# EAGLE design Aux_pcb (EAGLE 9.2.0)
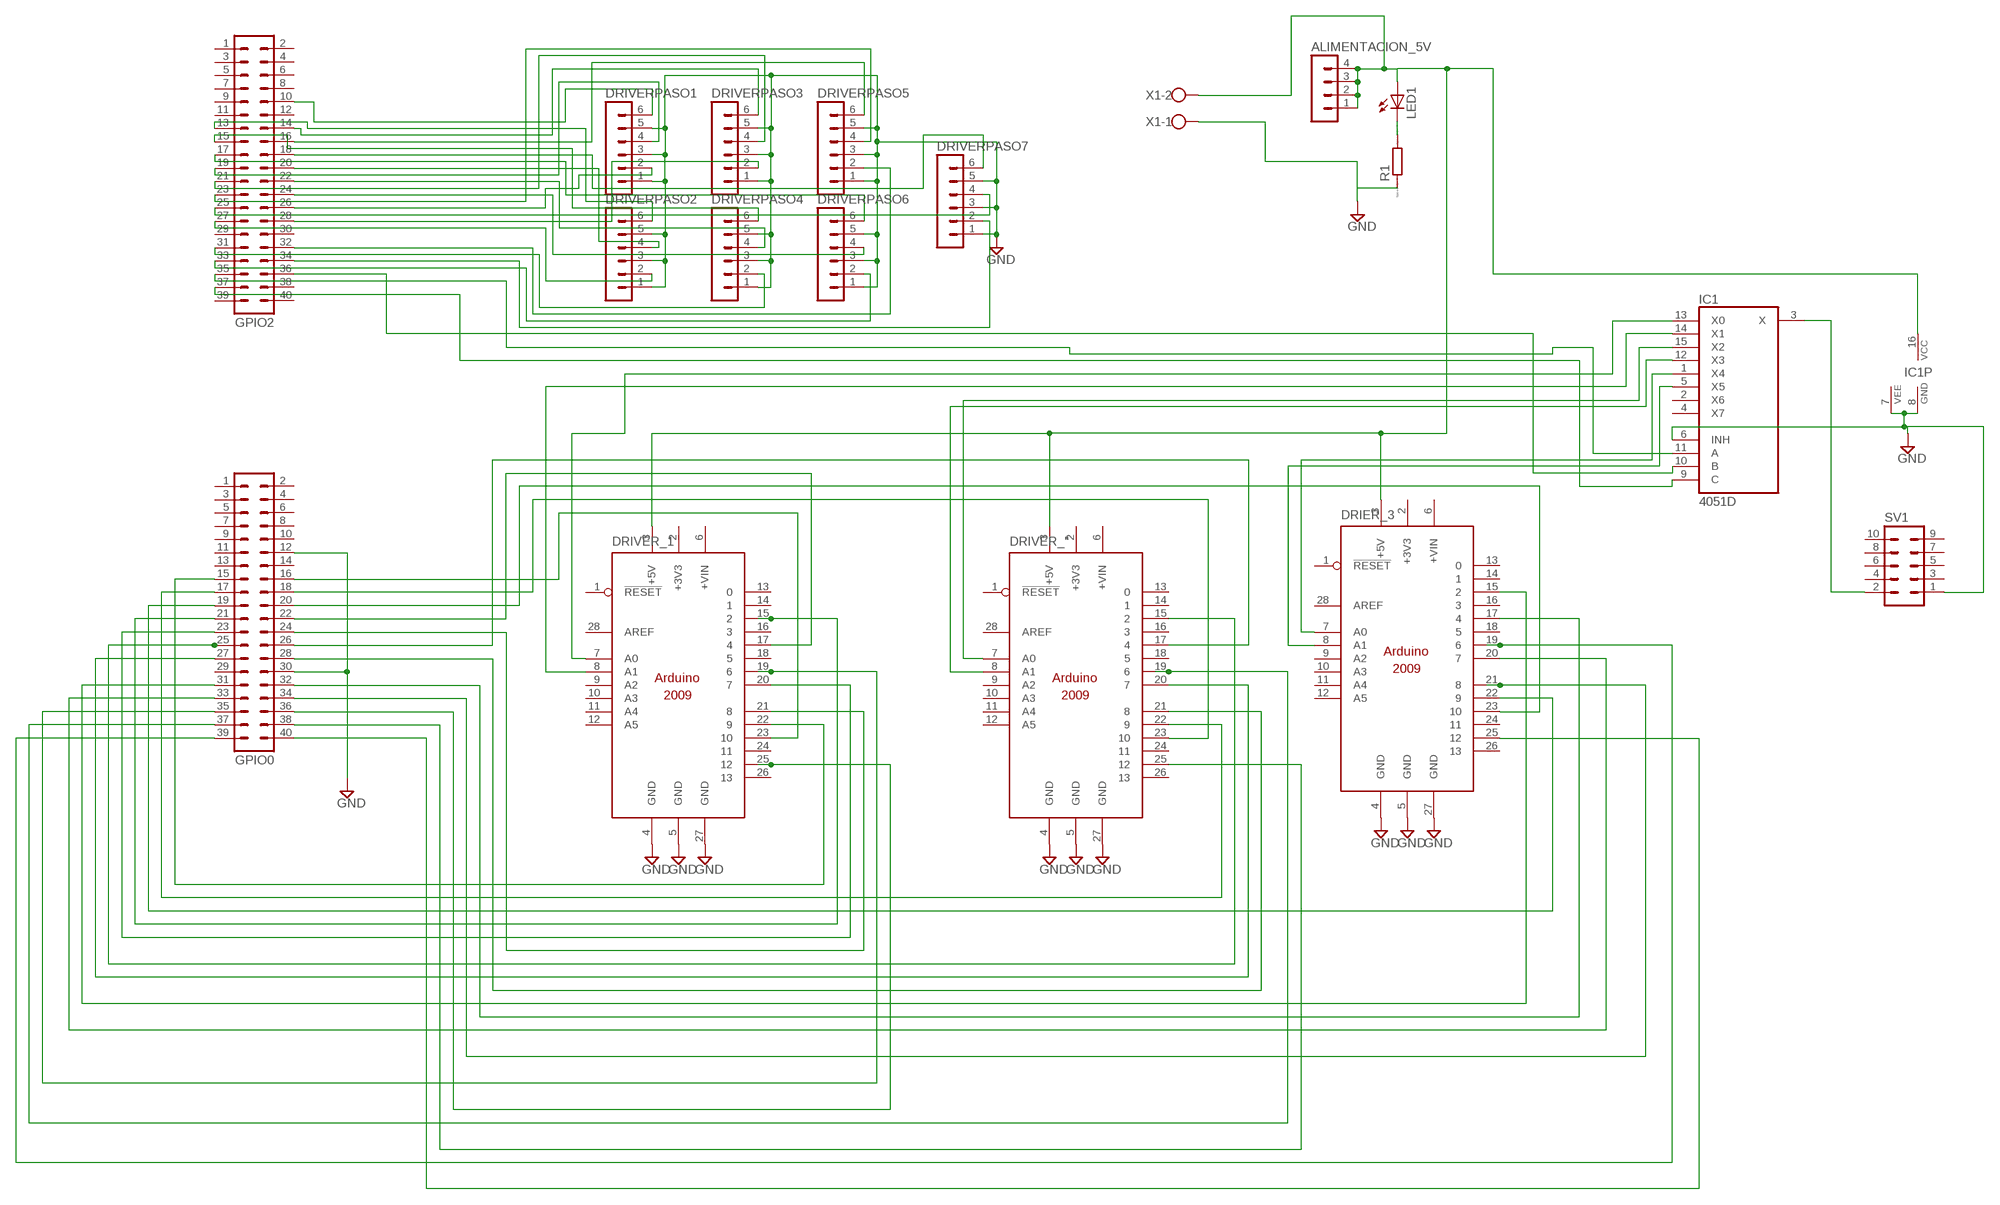
[diagram p0: schematic, sheet 1]

## Parts
ALIMENTACION_5V  MA04-1  [MA04-1]
DRIER_3  ARDUINO2009_10  [ARDUINO2009]
DRIVER_1  ARDUINO2009_10  [ARDUINO2009]
DRIVER_"  ARDUINO2009_10  [ARDUINO2009]
DRIVERPASO1  MA06-1  [MA06-1]
DRIVERPASO2  MA06-1  [MA06-1]
DRIVERPASO3  MA06-1  [MA06-1]
DRIVERPASO4  MA06-1  [MA06-1]
DRIVERPASO5  MA06-1  [MA06-1]
DRIVERPASO6  MA06-1  [MA06-1]
DRIVERPASO7  MA06-1  [MA06-1]
GPIO0  MA20-2  [MA20-2]
GPIO2  MA20-2  [MA20-2]
IC1  4051D  [SO16]
LED1  LEDSML0805  [SML0805]
R1  RR1206  [R1206]
SV1  MA05-2  [MA05-2]
X1  W237-102  [W237-102]

## Nets
+5V: ALIMENTACION_5V.1 ALIMENTACION_5V.2 ALIMENTACION_5V.3 ALIMENTACION_5V.4 DRIER_3.3(+5V) DRIVER_1.3(+5V) DRIVER_".3(+5V) IC1.16(VCC) LED1.A X1.2
GND: DRIER_3.4(GND) DRIER_3.5(GND) DRIER_3.27(GND) DRIVER_1.4(GND) DRIVER_1.5(GND) DRIVER_1.27(GND) DRIVER_".4(GND) DRIVER_".5(GND) DRIVER_".27(GND) DRIVERPASO1.1 DRIVERPASO1.3 DRIVERPASO1.5 DRIVERPASO2.1 DRIVERPASO2.3 DRIVERPASO2.5 DRIVERPASO3.1 DRIVERPASO3.3 DRIVERPASO3.5 DRIVERPASO4.1 DRIVERPASO4.3 DRIVERPASO4.5 DRIVERPASO5.1 DRIVERPASO5.3 DRIVERPASO5.5 DRIVERPASO6.1 DRIVERPASO6.3 DRIVERPASO6.5 DRIVERPASO7.1 DRIVERPASO7.3 DRIVERPASO7.5 GPIO0.12 GPIO0.30 IC1.6(INH) IC1.7(VEE) IC1.8(GND) R1.1 SV1.1 X1.1
N$2: DRIVER_1.7(A0) IC1.13(X0)
N$6: DRIVERPASO1.6 GPIO2.10
N$7: DRIVERPASO2.6 GPIO2.13
N$8: DRIVERPASO3.6 GPIO2.14
N$9: DRIVERPASO4.6 GPIO2.15
N$10: DRIVERPASO5.6 GPIO2.16
N$11: DRIVERPASO6.6 GPIO2.17
N$12: DRIVERPASO7.6 GPIO2.18
N$13: DRIVER_1.22 GPIO0.15
N$14: DRIVER_1.23 GPIO0.16
N$15: DRIVER_".22 GPIO0.17
N$16: DRIVER_".23 GPIO0.18
N$17: DRIER_3.22 GPIO0.19
N$18: DRIER_3.23 GPIO0.20
N$19: DRIVER_1.15 GPIO0.21
N$20: DRIVER_1.17 GPIO0.22
N$21: DRIVER_1.20 GPIO0.23
N$22: DRIVER_1.21 GPIO0.24
N$23: DRIVER_".15 GPIO0.25
N$24: DRIVER_".17 GPIO0.26
N$25: DRIVER_".20 GPIO0.27
N$26: DRIVER_".21 GPIO0.28
N$27: DRIER_3.15 GPIO0.31
N$28: DRIER_3.17 GPIO0.32
N$29: DRIER_3.20 GPIO0.33
N$30: DRIER_3.21 GPIO0.34
N$31: DRIVER_1.19 GPIO0.35
N$32: DRIVER_1.25 GPIO0.36
N$33: DRIVER_".19 GPIO0.37
N$34: DRIVER_".25 GPIO0.38
N$35: DRIER_3.19 GPIO0.39
N$36: DRIER_3.25 GPIO0.40
N$37: DRIVERPASO1.4 GPIO2.19
N$38: DRIVERPASO2.4 GPIO2.20
N$39: DRIVERPASO3.4 GPIO2.21
N$40: DRIVERPASO4.4 GPIO2.22
N$41: DRIVERPASO5.4 GPIO2.23
N$42: DRIVERPASO6.4 GPIO2.24
N$43: DRIVERPASO7.4 GPIO2.25
N$44: DRIVERPASO1.2 GPIO2.26
N$45: DRIVERPASO2.2 GPIO2.27
N$46: DRIVERPASO3.2 GPIO2.28
N$47: DRIVERPASO4.2 GPIO2.31
N$48: DRIVERPASO5.2 GPIO2.32
N$49: DRIVERPASO6.2 GPIO2.33
N$50: DRIVERPASO7.2 GPIO2.34
N$51: DRIVER_1.8(A1) IC1.14(X1)
N$52: DRIVER_".7(A0) IC1.15(X2)
N$53: DRIVER_".8(A1) IC1.12(X3)
N$54: DRIER_3.7(A0) IC1.1(X4)
N$55: DRIER_3.8(A1) IC1.5(X5)
N$56: IC1.3(X) SV1.2
N$58: GPIO2.35 IC1.11(A)
N$59: GPIO2.36 IC1.10(B)
N$60: GPIO2.37 IC1.9(C)
N$167: LED1.C R1.2
Unconnected: DRIER_3.1(!RESET) DRIER_3.6(+VIN) DRIER_3.9(A2) DRIER_3.10(A3) DRIER_3.11(A4) DRIER_3.12(A5) DRIER_3.13 DRIER_3.14 DRIER_3.16 DRIER_3.18 DRIER_3.24 DRIER_3.26 DRIER_3.28(AREF) DRIVER_1.1(!RESET) DRIVER_1.6(+VIN) DRIVER_1.9(A2) DRIVER_1.10(A3) DRIVER_1.11(A4) DRIVER_1.12(A5) DRIVER_1.13 DRIVER_1.14 DRIVER_1.16 DRIVER_1.18 DRIVER_1.24 DRIVER_1.26 DRIVER_1.28(AREF) DRIVER_".1(!RESET) DRIVER_".6(+VIN) DRIVER_".9(A2) DRIVER_".10(A3) DRIVER_".11(A4) DRIVER_".12(A5) DRIVER_".13 DRIVER_".14 DRIVER_".16 DRIVER_".18 DRIVER_".24 DRIVER_".26 DRIVER_".28(AREF) GPIO0.1 GPIO0.2 GPIO0.3 GPIO0.4 GPIO0.5 GPIO0.6 GPIO0.7 GPIO0.8 GPIO0.9 GPIO0.10 GPIO0.11 GPIO0.13 GPIO0.14 GPIO0.29 GPIO2.1 GPIO2.2 GPIO2.3 GPIO2.4 GPIO2.5 GPIO2.6 GPIO2.7 GPIO2.8 GPIO2.9 GPIO2.11 GPIO2.12 GPIO2.29 GPIO2.30 GPIO2.38 GPIO2.39 GPIO2.40 IC1.2(X6) IC1.4(X7) SV1.3 SV1.4 SV1.5 SV1.6 SV1.7 SV1.8 SV1.9 SV1.10

## Power pins joined to a net without a drawn wire
+3V3: DRIER_3.2(+3V3) DRIVER_1.2(+3V3) DRIVER_".2(+3V3)

## Library data of the parts
ALIMENTACION_5V = con-lstb:MA04-1: PIN HEADER; OC_FARNELL: unknown; OC_NEWARK: unknown
DRIER_3 DRIVER_1 DRIVER_" = arduino:ARDUINO2009_1: The Arduino Duemilanove ("2009") is a microcontroller board based on the ATmega168 or ATmega328. - 14 digital input/output pins (of which 6 can be used as PWM outputs) - 6 analog inputs, a 16 MHz crystal oscillator - USB connection - power jack - ISP header - reset button It contains everything needed to support the microcontroller; simply connect it to a computer with a USB cable or power it with a AC-to-DC adapter or battery to get started http://arduino.cc/en/Main/ArduinoBoardDuemilanove
DRIVERPASO1-DRIVERPASO7 = con-lstb:MA06-1: PIN HEADER; OC_FARNELL: unknown; OC_NEWARK: unknown
GPIO0 GPIO2 = con-lstb:MA20-2: PIN HEADER; OC_FARNELL: unknown; OC_NEWARK: unknown
IC1 = 40xx:4051: 8-channel ANALOG MULTIPLEXER
LED1 = led:LED: LED OSRAM: - CHIPLED LG R971, LG N971, LY N971, LG Q971, LY Q971, LO R971, LY R971 LH N974, LH R974 LS Q976, LO Q976, LY Q976 LO Q996 - Hyper CHIPLED LW Q18S LB Q993, LB Q99A, LB R99A - SideLED LS A670, LO A670, LY A670, LG A670, LP A670 LB A673, LV A673, LT A673, LW A673 LH A674 LY A675 LS A676, LA A676, LO A676, LY A676, LW A676 LS A679, LY A679, LG A679 - Hyper Micro SIDELED® LS Y876, LA Y876, LO Y876, LY Y876 LT Y87S - SmartLED LW L88C, LW L88S LB L89C, LB L89S, LG L890 LS L89K, LO L89K, LY L89K LS L896, LA L896, LO L896, LY L896 - TOPLED LS T670, LO T670, LY T670, LG T670, LP T670 LSG T670, LSP T670, LSY T670, LOP T670, LYG T670 LG T671, LOG T671, LSG T671 LB T673, LV T673, LT T673, LW T673 LH T674 LS T676, LA T676, LO T676, LY T676, LB T676, LH T676, LSB T676, LW T676 LB T67C, LV T67C, LT T67C, LS T67K, LO T67K, LY T67K, LW E67C LS E67B, LA E67B, LO E67B, LY E67B, LB E67C, LV E67C, LT E67C LW T67C LS T679, LY T679, LG T679 LS T770, LO T770, LY T770, LG T770, LP T770 LB T773, LV T773, LT T773, LW T773 LH T774 LS E675, LA E675, LY E675, LS T675 LS T776, LA T776, LO T776, LY T776, LB T776 LHGB T686 LT T68C, LB T68C - Hyper Mini TOPLED® LB M676 - Mini TOPLED Santana® LG M470 LS M47K, LO M47K, LY M47K Source: http://www.osram.convergy.de LUXEON: - LUMILED® LXK2-PW12-R00, LXK2-PW12-S00, LXK2-PW14-U00, LXK2-PW14-V00 LXK2-PM12-R00, LXK2-PM12-S00, LXK2-PM14-U00 LXK2-PE12-Q00, LXK2-PE12-R00, LXK2-PE12-S00, LXK2-PE14-T00, LXK2-PE14-U00 LXK2-PB12-K00, LXK2-PB12-L00, LXK2-PB12-M00, LXK2-PB14-N00, LXK2-PB14-P00, LXK2-PB14-Q00 LXK2-PR12-L00, LXK2-PR12-M00, LXK2-PR14-Q00, LXK2-PR14-R00 LXK2-PD12-Q00, LXK2-PD12-R00, LXK2-PD12-S00 LXK2-PH12-R00, LXK2-PH12-S00 LXK2-PL12-P00, LXK2-PL12-Q00, LXK2-PL12-R00 Source: www.luxeon.com KINGBRIGHT: KA-3528ASYC Source: www.kingbright.com
R1 = eagle-ltspice:R: RESISTOR, European symbol; SPICEMODEL: NONE; SPICEPREFIX: R
SV1 = con-lstb:MA05-2: PIN HEADER; OC_FARNELL: unknown; OC_NEWARK: unknown
X1 = con-wago-500:W237-102: WAGO SCREW CLAMP; MPN: 237-102; OC_FARNELL: unknown; OC_NEWARK: 70K9898

## Board
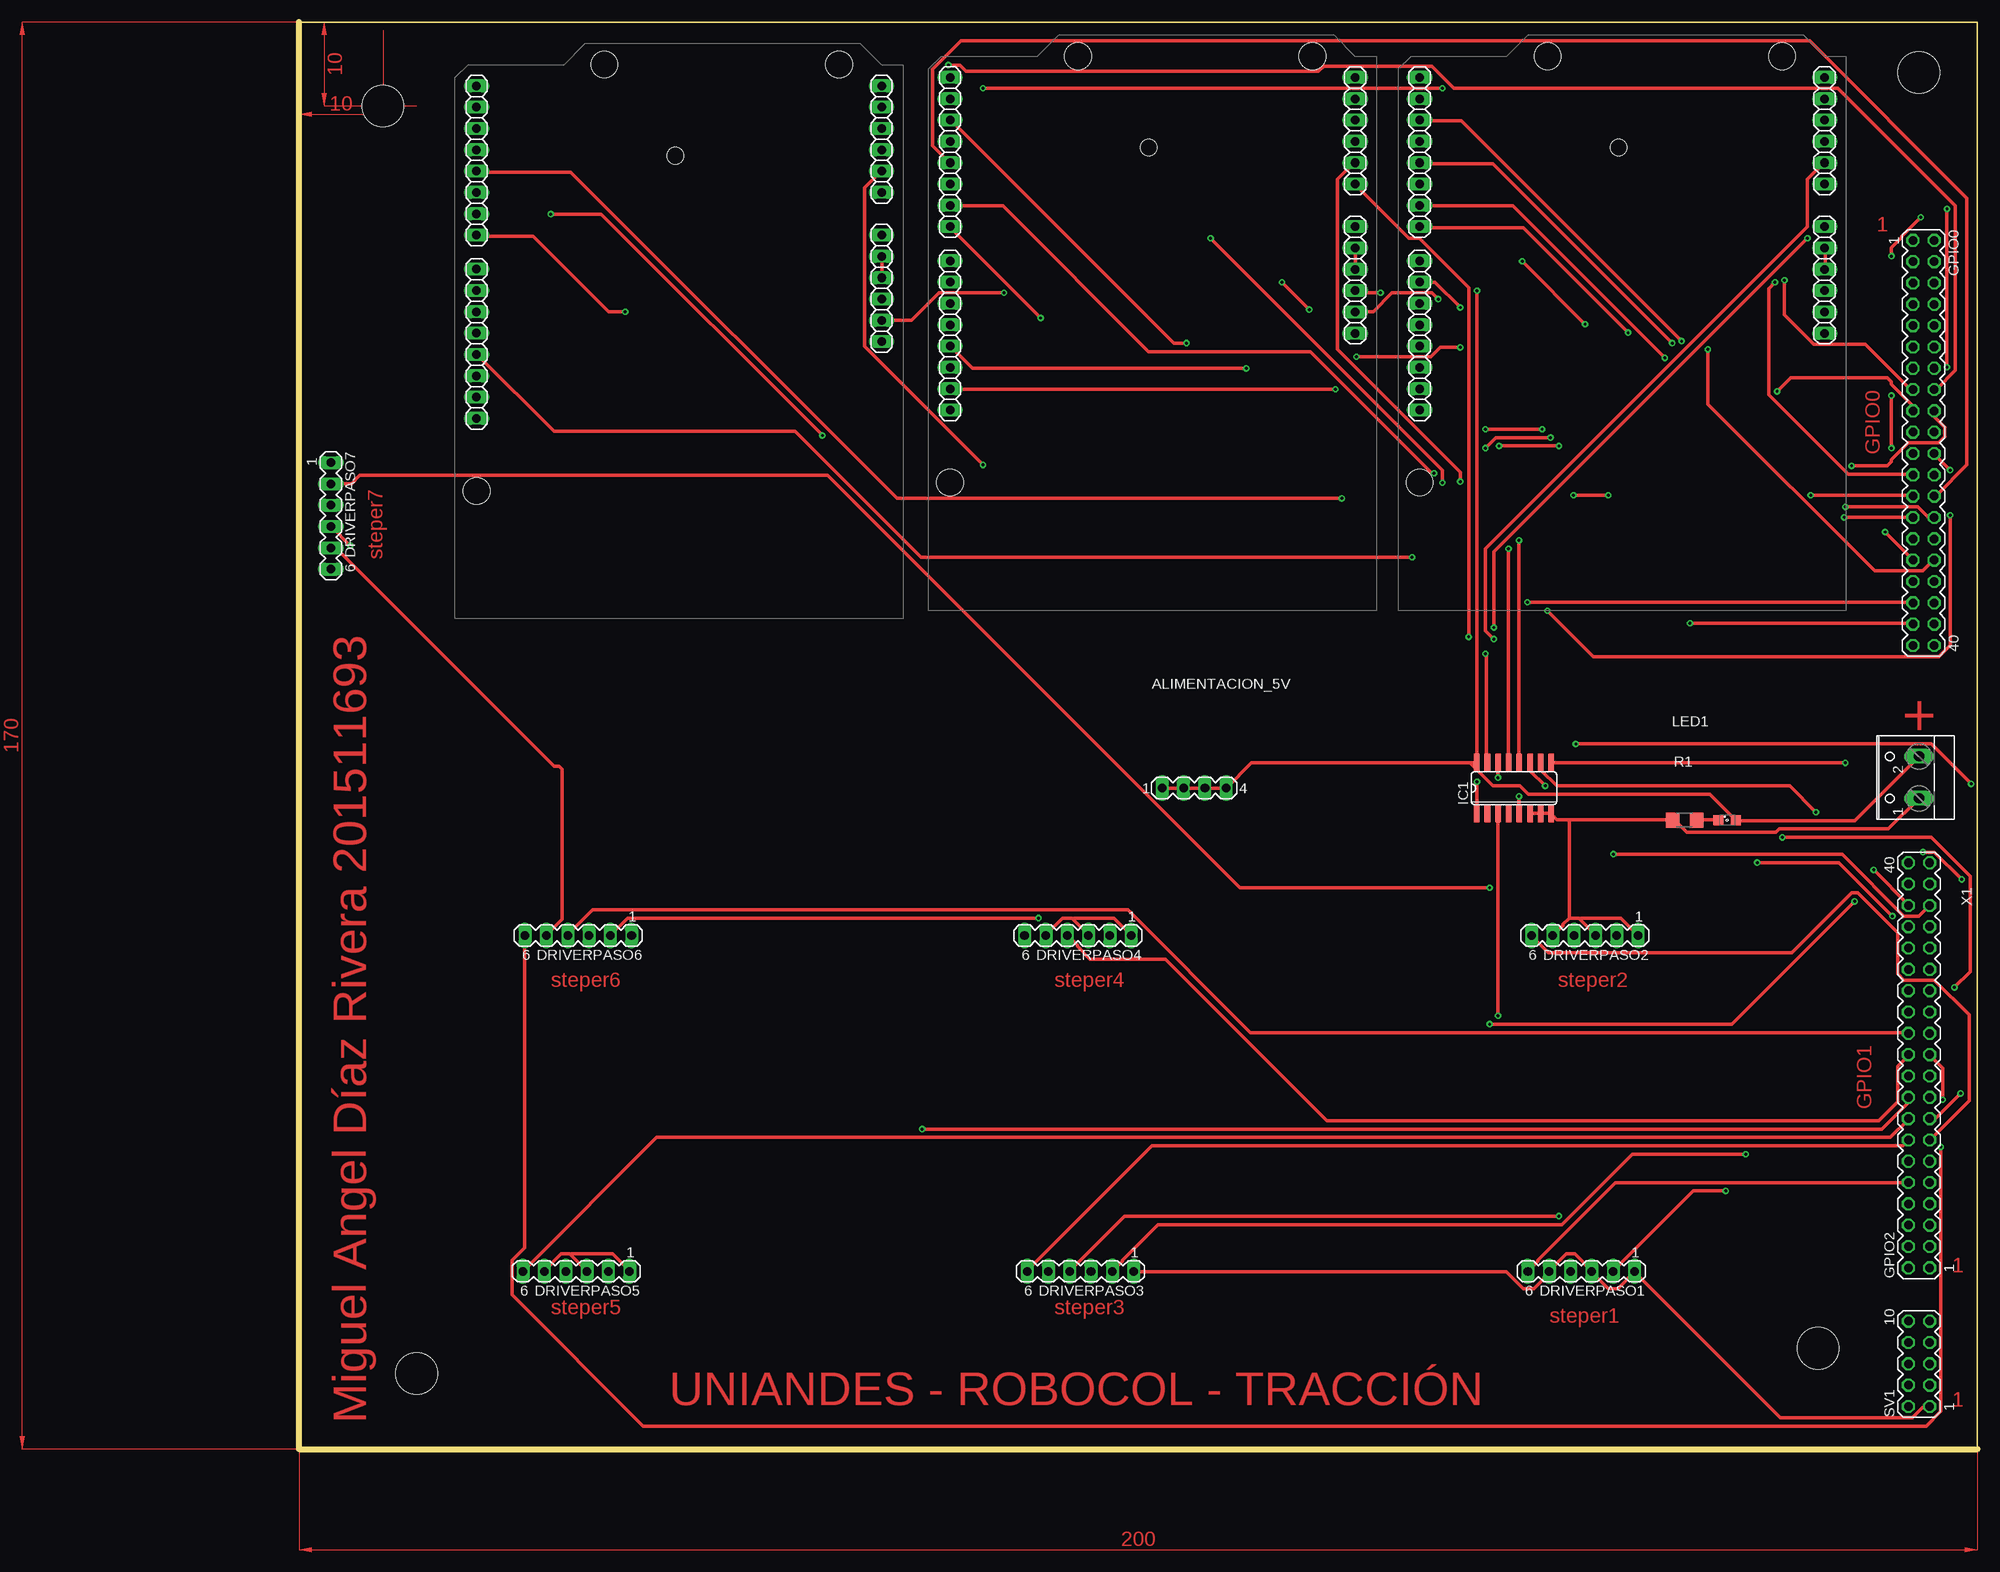
[diagram p1: board, top side]
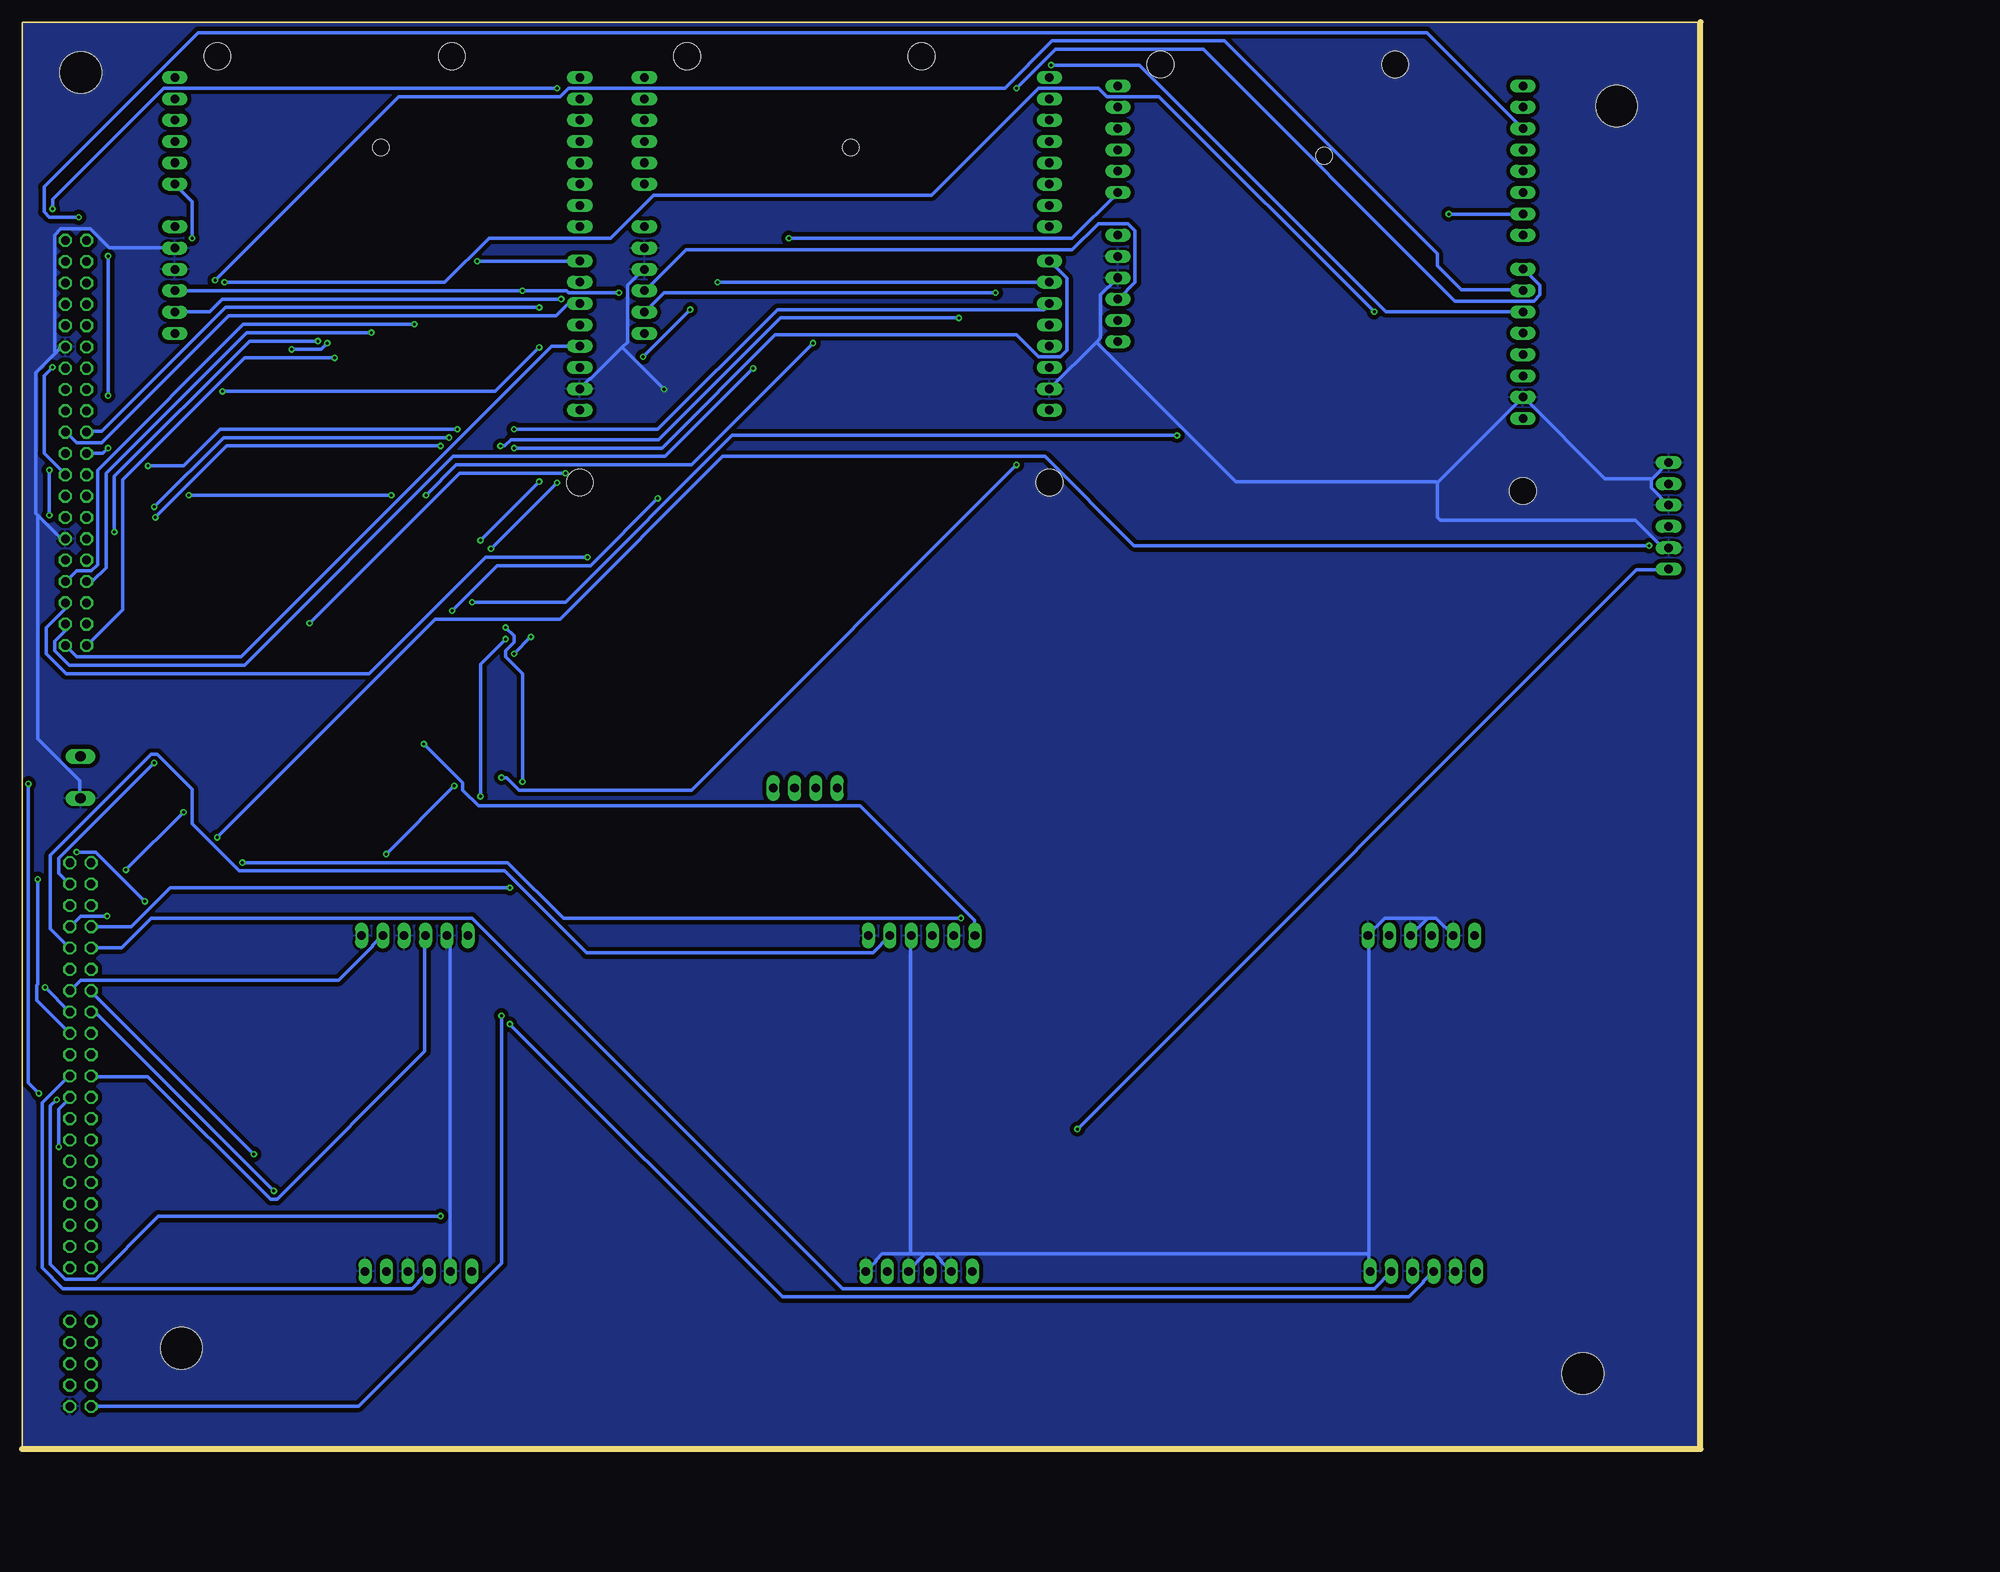
[diagram p2: board, bottom side, seen from below]

Size 200 x 170 mm. Coordinates in mm from the lower left corner, seen from the top.
Outline: 200,0 200,170 0,170 0,0 200,0
Copper layers (1*16): Top 0.035mm / dielectric 1.5mm / Bottom 0.035mm
Design rules "default *": minimum track width 0.4mm, minimum drill 0.35mm, track to track 0.5mm, track to pad 0.3mm, pad to pad 0.3mm, via to via 0.3mm, smd to smd 0.4mm, copper to edge 0mil, drill to drill 8mil, minimum pad ring 10mil, minimum via ring 8mil, stop-mask expansion 4mil, vias tented up to drill 0mil, thermal gap 12mil
Holes 5 mm at 10,160 14,9 181,12 193,164

### Footprints (pad centres in the part's own frame; a part is rotated, then mirrored left to right if it is on the bottom)
MA04-1 = drill 1.016 long: 1 -3.81,0; 2 -1.27,0; 3 1.27,0; 4 3.81,0
ARDUINO2009 = drill 1.016 long: 1 33.02,2.54; 2 35.56,2.54; 3 38.1,2.54; 4 40.64,2.54; 5 43.18,2.54; 6 45.72,2.54; 7 50.8,2.54; 8 53.34,2.54; 9 55.88,2.54; 10 58.42,2.54; 11 60.96,2.54; 12 63.5,2.54; 13 63.5,50.8; 14 60.96,50.8; 15 58.42,50.8; 16 55.88,50.8; 17 53.34,50.8; 18 50.8,50.8; 19 48.26,50.8; 20 45.72,50.8; 21 41.656,50.8; 22 39.116,50.8; 23 36.576,50.8; 24 34.036,50.8; 25 31.496,50.8; 26 28.956,50.8; 27 26.416,50.8; 28 23.876,50.8 | hole 3.2: 15.24,50.8; 66.04,35.56; 66.04,7.62 | hole 2: 55.17,27.114
MA06-1 = drill 1.016 long: 1 -6.35,0; 2 -3.81,0; 3 -1.27,0; 4 1.27,0; 5 3.81,0; 6 6.35,0
MA20-2 = drill 1.016 octagon: 1 -24.13,-1.27; 2 -24.13,1.27; 3 -21.59,-1.27; 4 -21.59,1.27; 5 -19.05,-1.27; 6 -19.05,1.27; 7 -16.51,-1.27; 8 -16.51,1.27; 9 -13.97,-1.27; 10 -13.97,1.27; 11 -11.43,-1.27; 12 -11.43,1.27; 13 -8.89,-1.27; 14 -8.89,1.27; 15 -6.35,-1.27; 16 -6.35,1.27; 17 -3.81,-1.27; 18 -3.81,1.27; 19 -1.27,-1.27; 20 -1.27,1.27; 21 1.27,-1.27; 22 1.27,1.27; 23 3.81,-1.27; 24 3.81,1.27; 25 6.35,-1.27; 26 6.35,1.27; 27 8.89,-1.27; 28 8.89,1.27; 29 11.43,-1.27; 30 11.43,1.27; 31 13.97,-1.27; 32 13.97,1.27; 33 16.51,-1.27; 34 16.51,1.27; 35 19.05,-1.27; 36 19.05,1.27; 37 21.59,-1.27; 38 21.59,1.27; 39 24.13,-1.27; 40 24.13,1.27
SO16 = smd 0.66 x 2.032: 1 -4.445,-3.073; 2 -3.175,-3.073; 3 -1.905,-3.073; 4 -0.635,-3.073; 5 0.635,-3.073; 6 1.905,-3.073; 7 3.175,-3.073; 8 4.445,-3.073; 9 4.445,3.073; 10 3.175,3.073; 11 1.905,3.073; 12 0.635,3.073; 13 -0.635,3.073; 14 -1.905,3.073; 15 -3.175,3.073; 16 -4.445,3.073
SML0805 = smd 1.2 x 1.2: A 1.05,0; C -1.05,0
R1206 = smd 1.6 x 1.803: 1 -1.422,0; 2 1.422,0
MA05-2 = drill 1.016 octagon: 1 -5.08,-1.27; 2 -5.08,1.27; 3 -2.54,-1.27; 4 -2.54,1.27; 5 0,-1.27; 6 0,1.27; 7 2.54,-1.27; 8 2.54,1.27; 9 5.08,-1.27; 10 5.08,1.27
W237-102 = drill 1.194 long: 1 -2.5,-1.27; 2 2.5,-1.27

### Placement (x,y rotation side)
ALIMENTACION_5V  106.68,78.74 0 top
DRIER_3  184.34,99.9 90 top
DRIVER_1  71.96,98.9 90 top
DRIVER_"  128.38,99.9 90 top
DRIVERPASO1  152.78,21.18 180 top
DRIVERPASO2  153.21,61.18 180 top
DRIVERPASO3  93.1,21.18 180 top
DRIVERPASO4  92.8,61.18 180 top
DRIVERPASO5  33.04,21.18 180 top
DRIVERPASO6  33.28,61.18 180 top
DRIVERPASO7  3.79,111.18 270 top
GPIO0  193.58,119.87 270 top
GPIO2  193.04,45.72 90 top
IC1  144.78,78.74 0 top
LED1  170.18,74.93 0 top
R1  165.1,74.93 0 top
SV1  193.04,10.16 90 top
X1  191.77,80.01 90 top

### Tracks (layer width: path | path; a pad name or v marks a point on that pad's centre or on a via)
+3V3  (via drill 0.35)
  Top 0.4: v84,137.75 76.25,137.75 73,134.5 69.5,134.5 DRIVER_1.2 | v135.75,137 135,137.75 130.25,137.75 128,135.5 125.88,135.5 DRIVER_".2
  Bottom 0.4: v84,137.75 123.5,137.75 125.75,135.5 DRIVER_".2 | v135.75,137 176.12,137 177.62,135.5 181.75,135.5 DRIER_3.2
+5V  (via drill 0.35)
  Top 0.4: X1.2 193,82.5 185.38,74.88 171.25,74.88 LED1.A 171.12,75 168.12,78 146.5,78 145.5,79 142.25,79 139.62,81.62 139.62,81.75 | ALIMENTACION_5V.1 105.38,78.75 ALIMENTACION_5V.2 105.5,78.75 107.75,78.75 ALIMENTACION_5V.3 108,78.75 110.38,78.75 ALIMENTACION_5V.4 113.5,81.75 139.62,81.75 | 139.62,81.75 140.25,81.75 IC1.16 140.38,82 v140.38,138 | v128.88,137.75 126.12,137.75 125.88,138 DRIVER_".3
  Bottom 0.4: DRIVER_1.3 69.38,137 67.38,139 67.38,145.12 68.25,146 71.75,146 74.88,142.88 120.88,142.88 125.75,138 DRIVER_".3 | DRIER_3.3 v140.38,138 135.12,138 134.88,137.75 v128.88,137.75
GND  (via drill 0.35)
  Top 0.4: DRIVER_".4 125.88,140.62 125.88,143 DRIVER_".5 | DRIVER_1.4 69.5,139.62 69.5,142 DRIVER_1.5 | v123.5,126.25 77.62,126.25 DRIVER_".27 | 32.38,23.12 34.25,21.25 DRIVERPASO5.3 | 32.38,23.12 32.25,23.25 31.25,23.25 29.25,21.25 DRIVERPASO5.5 | DRIVERPASO5.1 39.38,21.25 37.38,23.25 32.5,23.25 32.38,23.12 | 92.25,63.12 94.12,61.25 DRIVERPASO4.3 | 92.25,63.12 92.12,63.25 91,63.25 89,61.25 DRIVERPASO4.5 | DRIVERPASO4.1 99.12,61.25 97.12,63.25 92.38,63.25 92.25,63.12 | SV1.1 194.25,5 193.5,5 192.25,3.75 176.5,3.75 159.25,21 DRIVERPASO1.1 159.12,21.12 157.12,19.12 156,19.12 154.12,21 DRIVERPASO1.3 154,21.25 152,23.25 151,23.25 149,21.25 DRIVERPASO1.5 149,21 147.12,19.12 145.88,19.12 143.88,21.12 99.5,21.12 DRIVERPASO3.1 | 151.38,63.25 150.62,62.5 150.62,62.38 149.5,61.25 DRIVERPASO2.5 | 151.38,63.25 152.5,63.25 152.62,63.12 | 152.62,63.12 154.5,61.25 DRIVERPASO2.3 | DRIVERPASO2.1 159.5,61.25 157.5,63.25 152.75,63.25 152.62,63.12 | IC1.6 146.75,75.75 147.88,75.75 IC1.7 148.12,75.75 149.12,75.75 IC1.8 149.25,75.62 149.88,75 151.38,75 | 151.38,75 163.62,75 R1.1 163.88,75 165.38,73.5 176,73.5 176.38,73.88 189.38,73.88 193,77.5 X1.1 | 151.38,75 151.38,63.25 | DRIER_3.4 181.88,140.62 181.88,143 DRIER_3.5 | DRIVERPASO7.5 3.88,107.25 4.5,107.25 29.88,81.88 30.38,81.38 31,81.38 31.38,81 31.38,63.12 29.5,61.25 DRIVERPASO6.5
  Bottom 0.4: 128.5,131.25 127.88,131.88 127.88,138.62 125.88,140.62 DRIVER_".4 | 128.5,131.25 132.25,127.5 132.38,127.5 133.5,126.38 DRIER_3.27 | 72,131.88 71.5,132.38 71.5,137.5 69.5,139.5 DRIVER_1.4 | 72,131.88 77.5,126.38 DRIVER_".27 | 5.88,115.5 5.88,114.5 3.88,112.5 DRIVERPASO7.3 | 5.88,115.5 3.88,117.5 DRIVERPASO7.1 | 31.38,115.12 31.38,111 31,110.62 7.75,110.62 4.5,107.38 3.88,107.38 DRIVERPASO7.5 | 31.38,115.12 21.25,125.25 DRIVER_1.27 21,125.25 11.38,115.62 6,115.62 5.88,115.5 | 72,131.88 55.38,115.25 31.5,115.25 31.38,115.12 | v123.5,126.25 128.5,131.25 | 32.62,63.12 34.5,61.25 DRIVERPASO6.3 | 32.62,63.12 32.5,63.25 31.5,63.25 29.5,61.25 DRIVERPASO6.5 | 32.62,63.12 32.75,63.25 37.62,63.25 39.62,61.25 DRIVERPASO6.1 39.5,61.12 39.5,23.25 | 39.5,23.25 39.5,21.25 DRIVERPASO5.1 | 91.12,23.12 91.25,23.25 92.38,23.25 92.5,23.12 | 91.12,23.12 90.5,22.5 90.5,22.38 89.38,21.25 DRIVERPASO3.5 | 92.5,23.12 94.38,21.25 DRIVERPASO3.3 | 94.12,23.25 92.62,23.25 92.5,23.12 | 94.12,23.25 97.5,23.25 98.25,22.5 98.25,22.38 99.38,21.25 DRIVERPASO3.1 | 94.12,23.25 94.12,61.12 DRIVERPASO4.3 | 39.5,23.25 91,23.25 91.12,23.12 | 198,111.12 198.38,111.5 198.38,128.25 196,130.62 | 198,111.12 195.38,108.5 194.88,108.5 GPIO0.30 | 196,130.62 195.38,131.25 194.88,131.25 GPIO0.12 | X1.1 193.12,77.62 193.12,79.62 198.12,84.62 198.12,111 198,111.12 | DRIER_3.5 181.88,143.12 189.62,143.12 191.88,145.38 195.38,145.38 196.12,144.62 196.12,130.75 196,130.62 | DRIVERPASO1.5 149,21.25 149,60.75 149.38,61.12 DRIVERPASO2.5
  pour Bottom: 0,0 200,0 200,22 200,170 0,170
N$2  (via drill 0.35)
  Top 0.4: v144.12,107.25 144.12,81.88 IC1.13 | v136.25,115.12 136.25,116.62 v108.62,144.25
  Bottom 0.4: v136.25,115.12 v144.12,107.25 | v108.62,144.25 74.88,144.25 69.5,149.62 DRIVER_1.7
N$6
  Top 0.4: DRIVERPASO1.6 147.62,22.38 147.62,22.5 156.88,31.75 GPIO2.10
N$7
  Top 0.4: DRIVERPASO2.6 146.88,61.12 148.88,59.12 177.88,59.12 185,66.25 185.75,66.25 190.5,61.5 190.5,56.62 191.25,55.88 194.88,55.88 199,51.75 199,41.5 194.38,36.88 GPIO2.13
N$8
  Top 0.4: DRIVERPASO3.6 86.75,21.25 101.62,36.12 191.12,36.12 191.75,36.75 GPIO2.14
N$9  (via drill 0.35)
  Top 0.4: v152.12,84 194.5,84 v199.25,79.25 | v198,42.38 195,39.38 194.38,39.38 GPIO2.15
  Bottom 0.4: v152.12,84 147.5,79.38 147.5,78.5 145.62,76.62 100.12,76.62 86.5,63 86.5,61.25 DRIVERPASO4.6 | v199.25,79.25 199.25,43.62 v198,42.38
N$10
  Top 0.4: DRIVERPASO5.6 26.75,21.25 42.62,37.12 189.62,37.12 191.75,39.25 GPIO2.16
N$11  (via drill 0.35)
  Top 0.4: v195.62,36 195.62,4.5 193.88,2.75 41,2.75 25.38,18.38 25.38,22.5 26.88,24 26.88,61.12 DRIVERPASO6.6
  Bottom 0.4: v195.62,36 195.62,40.5 194.25,41.88 GPIO2.17
N$12  (via drill 0.35)
  Top 0.4: v74.25,38.12 188.62,38.12 191.75,41.25 191.75,41.88 GPIO2.18
  Bottom 0.4: v74.25,38.12 7.62,104.75 3.88,104.75 DRIVERPASO7.6
N$13  (via drill 0.35)
  Top 0.4: v177,139.25 177,135.12 180.5,131.62 186.62,131.62 192,126.25 192.25,126.25 GPIO0.15
  Bottom 0.4: v177,139.25 155.12,161.12 135.88,161.12 134.88,162.12 82.88,162.12 77.25,167.75 56.75,167.75 31.38,142.38 31.38,141 28.5,138.12 21.25,138.12 DRIVER_1.22
N$14  (via drill 0.35)
  Top 0.4: v77.38,164.88 78.75,164.88 79.5,164.12 121.5,164.12 122.12,164.75 135,164.75 137.62,162.12 183.38,162.12 197.38,148.12 197.38,128.5 195.12,126.25 194.88,126.25 GPIO0.16
  Bottom 0.4: v77.38,164.88 66.88,164.88 37.5,135.5 21.25,135.5 DRIVER_1.23
N$15  (via drill 0.35)
  Top 0.4: v176.12,126 177.75,127.62 189.25,127.62 189.75,127.12 189.75,126.88 192.25,124.38 192.25,123.75 GPIO0.17 | v138.38,131.25 136,131.25 134.88,130.12 v126,130.12 | v117.12,139 v120.38,135.75
  Bottom 0.4: v176.12,126 143.62,126 v138.38,131.25 | v120.38,135.75 v126,130.12 | v117.12,139 77.62,139 DRIVER_".22
N$16  (via drill 0.35)
  Top 0.4: v185,117.12 189.25,117.12 189.75,117.62 189.75,117.88 191.75,119.88 195.38,119.88 196.12,120.62 196.12,121.75 194.88,123 194.88,123.62 GPIO0.18 | v141.38,121.5 v148.12,121.5
  Bottom 0.4: v185,117.12 180.75,117.12 176.38,121.5 v148.12,121.5 | v141.38,121.5 124.25,121.5 110,135.75 78.25,135.75 77.62,136.38 DRIVER_".23
N$17  (via drill 0.35)
  Top 0.4: v138.38,136 135.38,139 133.62,139 DRIER_3.22
  Bottom 0.4: v138.38,136 175.75,136 190.5,121.25 192.25,121.25 GPIO0.19
N$18
  Bottom 0.4: DRIER_3.23 133.62,136.38 135,136.38 136.38,135 175.38,135 190.5,119.88 193.5,119.88 194.75,121.12 GPIO0.20
N$19  (via drill 0.35)
  Top 0.4: v189.75,125.5 v189.75,119.25 | v189.75,142.12 189.75,143.12 191,144.38 191,144.5 v193.25,146.75
  Bottom 0.4: v189.75,119.25 190.38,118.62 192.25,118.62 GPIO0.21 | v189.75,142.12 v189.75,125.5 | v193.25,146.75 196.75,146.75 197.38,147.38 197.38,150.38 179,168.75 32.62,168.75 21.25,157.38 DRIVER_1.15
N$20  (via drill 0.35)
  Top 0.4: v196.75,116.62 194.88,118.5 GPIO0.22 | v196.75,111.25 196.75,95.75 195.38,94.38 154.25,94.38 v148.75,99.88 | v124.25,113.25 71.25,113.25 32.38,152.12 21.25,152.12 DRIVER_1.17
  Bottom 0.4: v196.75,111.25 v196.75,116.62 | v148.75,99.88 143.38,105.25 132.25,105.25 v124.25,113.25
N$21  (via drill 0.35)
  Top 0.4: v175.88,139 175.12,138.25 175.12,125.62 184.62,116.12 192.25,116.12 GPIO0.23 | v38.88,135.5 36.88,135.5 27.88,144.5 21.25,144.5 DRIVER_1.20
  Bottom 0.4: v175.88,139 149.62,139 144.38,144.25 129.88,144.25 124.75,149.38 91.62,149.38 78.88,162.12 71.75,162.12 70.75,161.12 64.5,161.12 v38.88,135.5
N$22  (via drill 0.35)
  Top 0.4: v196.38,147.75 v196.38,128.88 | v81.5,162.12 v136.25,162.12
  Bottom 0.4: v196.38,128.88 197.38,127.88 197.38,118.62 194.88,116.12 GPIO0.24 | v196.38,147.75 196.38,148.88 183.12,162.12 v136.25,162.12 | v81.5,162.12 76.88,166.75 59.25,166.75 29.25,136.75 19.88,136.75 19.12,137.5 19.12,138.62 21.12,140.62 DRIVER_1.21
N$23  (via drill 0.35)
  Top 0.4: v180.12,113.62 192.25,113.62 GPIO0.25 | v151.88,113.62 v156,113.62 | v105.75,131.75 104.25,131.75 77.62,158.38 DRIVER_".15
  Bottom 0.4: v156,113.62 v180.12,113.62 | v151.88,113.62 148.25,117.25 120.25,117.25 v105.75,131.75
N$24
  Top 0.4: GPIO0.26 194.88,113.62 195.12,113.62 198.75,117.25 198.75,149 180,167.75 78.88,167.75 75.5,164.38 75.5,155.25 77.5,153.25 DRIVER_".17
N$25  (via drill 0.35)
  Top 0.4: v184.12,111 192.25,111 GPIO0.27 | v143,119.5 v150.12,119.5 | v88.38,134.75 77.62,145.5 DRIVER_".20
  Bottom 0.4: v184.12,111 175.62,119.5 v150.12,119.5 | v143,119.5 142.5,119.5 141.75,120.25 124.12,120.25 109.62,134.75 v88.38,134.75
N$26  (via drill 0.35)
  Top 0.4: v184.25,112.25 192.88,112.25 194.12,111 194.75,111 GPIO0.28 | v149.12,120.5 142.62,120.5 v141.38,119.25
  Bottom 0.4: v184.25,112.25 176,120.5 v149.12,120.5 | v141.38,119.25 123.75,119.25 110.25,132.75 81.5,132.75 78.88,130.12 76.25,130.12 75.5,130.88 75.5,139.5 77.5,141.5 DRIVER_".21
N$27  (via drill 0.35)
  Top 0.4: v164.75,132 138.5,158.25 133.62,158.25 DRIER_3.15 | v189,109.25 192.25,106 GPIO0.31
  Bottom 0.4: v164.75,132 172.88,132 189,115.88 v189,109.25
N$28  (via drill 0.35)
  Top 0.4: v163.62,131.75 142.25,153.12 133.62,153.12 DRIER_3.17 | v167.88,131 167.88,124.5 187.75,104.62 193.5,104.62 194.75,105.88 GPIO0.32
  Bottom 0.4: v163.62,131.75 164.38,131 v167.88,131
N$29  (via drill 0.35)
  Top 0.4: v158.38,133 145.88,145.5 133.62,145.5 DRIER_3.20
  Bottom 0.4: v158.38,133 173.25,133 190,116.25 190,105 191.62,103.38 192.25,103.38 GPIO0.33
N$30  (via drill 0.35)
  Top 0.4: v153.25,134 v145.75,141.5
  Bottom 0.4: v145.75,141.5 133.62,141.5 DRIER_3.21 | v153.25,134 173.62,134 191,116.62 191,105.38 191.75,104.62 193.5,104.62 194.75,103.38 GPIO0.34
N$31  (via drill 0.35)
  Top 0.4: v146.38,100.88 192.25,100.88 GPIO0.35 | v62.38,120.75 36,147.12 v30,147.12
  Bottom 0.4: v146.38,100.88 135.25,100.88 115.38,120.75 v62.38,120.75 | v30,147.12 21.25,147.12 DRIVER_1.19
N$32  (via drill 0.35)
  Top 0.4: v132.62,106.25 74.12,106.25 59.12,121.25 30.38,121.25 21.25,130.38 DRIVER_1.25
  Bottom 0.4: v132.62,106.25 144.75,106.25 158.62,92.38 194.75,92.38 197.12,94.75 197.12,97.88 194.88,100.12 194.88,100.75 GPIO0.36
N$33  (via drill 0.35)
  Top 0.4: v165.75,98.38 192.25,98.38 GPIO0.37 | v135.25,116.25 135,116.25 120.5,130.75 101.25,130.75 83.88,148.12 77.62,148.12 DRIVER_".19
  Bottom 0.4: v165.75,98.38 147.88,116.25 v135.25,116.25
N$34  (via drill 0.35)
  Top 0.4: v112.88,128.75 80.25,128.75 77.62,131.38 DRIVER_".25
  Bottom 0.4: v112.88,128.75 123.38,118.25 148.62,118.25 173.5,93.38 194.38,93.38 196.12,95.12 196.12,96.25 194.88,97.5 194.88,98.25 GPIO0.38
N$35  (via drill 0.35)
  Top 0.4: v162.75,130 144.62,148.12 133.62,148.12 DRIER_3.19
  Bottom 0.4: v162.75,130 173.5,130 188,115.5 188,100 192.25,95.75 GPIO0.39
N$36
  Bottom 0.4: DRIER_3.25 133.62,131.38 136.88,131.38 173.88,94.38 193.5,94.38 194.75,95.62 GPIO0.40
N$37
  Bottom 0.4: DRIVERPASO1.4 151.62,21.12 152.75,20 152.75,19.88 153.5,19.12 195.12,19.12 197.62,21.62 197.62,41.25 194.38,44.5 GPIO2.19
N$38
  Bottom 0.4: GPIO2.20 191.75,44.38 185,44.38 170.38,29.75 169.62,29.75 152,47.38 152,61.12 DRIVERPASO2.4
N$39  (via drill 0.35)
  Top 0.4: v150.12,27.75 98.38,27.75 91.88,21.25 DRIVERPASO3.4 | v195.88,41.62 195.88,45.38 194.38,46.88 GPIO2.21
  Bottom 0.4: v150.12,27.75 183.75,27.75 191.25,20.25 194.88,20.25 196.62,22 196.62,40.88 v195.88,41.62
N$40
  Top 0.4: DRIVERPASO4.4 91.62,61.12 92.75,60 92.75,59.88 94.25,58.38 103.25,58.38 122.5,39.12 188.25,39.12 190.5,41.38 190.5,45.62 191.75,46.88 GPIO2.22
N$41  (via drill 0.35)
  Top 0.4: v141.88,50.62 170.75,50.62 v185.38,65.25 | v193.5,71.12 194.88,71.12 v198.12,67.88
  Bottom 0.4: v141.88,50.62 109.38,18.12 34.75,18.12 33,19.88 33,20 31.88,21.12 DRIVERPASO5.4 | v185.38,65.25 191.25,71.12 v193.5,71.12 | v198.12,67.88 198.12,55.38 198.25,55.25 198.25,53.5 194.38,49.62 GPIO2.23
N$42
  Top 0.4: GPIO2.24 191.75,49.62 113.38,49.62 98.75,64.25 35,64.25 32,61.25 DRIVERPASO6.4
N$43  (via drill 0.35)
  Top 0.4: v6.12,107.62 3.88,109.88 DRIVERPASO7.4 | v176.75,72.88 194.5,72.88 199.12,68.25 199.12,56.88 v197.25,55
  Bottom 0.4: v6.12,107.62 67.5,107.62 78.12,118.25 116.5,118.25 135.88,98.88 150.75,98.88 v176.75,72.88 | v197.25,55 194.38,52.12 GPIO2.25
N$44  (via drill 0.35)
  Top 0.4: v170,30.75 166.12,30.75 156.62,21.25 DRIVERPASO1.2
  Bottom 0.4: v170,30.75 191.25,52 191.75,52 GPIO2.26
N$45
  Bottom 0.4: DRIVERPASO2.2 157.12,61.12 158.25,60 158.25,59.88 162.25,55.88 193,55.88 194.25,54.62 GPIO2.27
N$46  (via drill 0.35)
  Top 0.4: v172.38,35.12 158.88,35.12 150.5,26.75 102.38,26.75 98.12,22.5 98.12,22.38 97,21.25 DRIVERPASO3.2
  Bottom 0.4: v172.38,35.12 191.75,54.5 GPIO2.28
N$47
  Bottom 0.4: DRIVERPASO4.2 96.62,61.12 98.62,59.12 132.75,59.12 142.5,68.88 174.12,68.88 179.75,74.5 179.75,78.62 183.88,82.75 184.62,82.75 196.62,70.75 196.62,62 194.38,59.75 GPIO2.31
N$48
  Bottom 0.4: DRIVERPASO5.2 36.88,21.12 38.88,19.12 102.25,19.12 146.38,63.25 184.62,63.25 188.12,59.75 191.75,59.75 GPIO2.32
N$49  (via drill 0.35)
  Top 0.4: v88.12,63.25 39.12,63.25 37.12,61.25 DRIVERPASO6.2 | v173.75,69.88 183.5,69.88 v189.88,63.5
  Bottom 0.4: v88.12,63.25 135.5,63.25 142.12,69.88 v173.75,69.88 | v189.88,63.5 193,63.5 194.25,62.25 GPIO2.33
N$50  (via drill 0.35)
  Top 0.4: v141.88,66.88 112.12,66.88 63,116 7.25,116 6.25,115 3.88,115 DRIVERPASO7.2
  Bottom 0.4: v141.88,66.88 182.38,66.88 187,62.25 191.75,62.25 GPIO2.34
N$51  (via drill 0.35)
  Top 0.4: v142.88,80 IC1.14 | v81.5,117.25 67.38,131.38 67.38,150.25 69.38,152.25 DRIVER_1.8
  Bottom 0.4: v142.88,80 142.25,80 140.75,78.5 120.25,78.5 v81.5,117.25
N$52  (via drill 0.35)
  Top 0.4: v141.38,94.75 141.5,94.62 141.5,81.88 IC1.15 | v139.38,96.75 139.38,138.38 133.5,144.25 132.25,144.25 125.88,150.62 DRIVER_".7
  Bottom 0.4: v139.38,96.75 v141.38,94.75
N$53  (via drill 0.35)
  Top 0.4: v145.38,108.25 145.38,81.88 IC1.12 | v138.38,115.25 138.38,116.38 123.75,131 123.75,151.25 125.75,153.25 DRIVER_".8
  Bottom 0.4: v138.38,115.25 v145.38,108.25
N$54  (via drill 0.35)
  Top 0.4: v140.38,79.5 140.38,75.75 IC1.1 | v142.38,97.88 142.38,106.88 v179.75,144.25
  Bottom 0.4: v140.38,79.5 140.38,92.38 142.38,94.38 142.38,95.12 141.38,96.12 141.38,96.88 v142.38,97.88 | v179.75,144.25 179.75,148.62 181.75,150.62 DRIER_3.7
N$55  (via drill 0.35)
  Top 0.4: v145.38,77.75 145.38,75.75 IC1.5 | v142.38,96.5 141.38,97.5 141.38,107.25 179.75,145.62 179.75,151.25 181.75,153.25 DRIER_3.8
  Bottom 0.4: v145.38,77.75 145.38,93.5 v142.38,96.5
N$56  (via drill 0.35)
  Top 0.4: v142.88,51.62 IC1.3
  Bottom 0.4: v142.88,51.62 142.88,22.12 159.88,5.12 191.75,5.12 SV1.2
N$58  (via drill 0.35)
  Top 0.4: v148.5,79 146.75,80.75 146.75,81.75 IC1.11 | v156.62,70.88 183.88,70.88 191.25,63.5 193,63.5 194.25,64.75 GPIO2.35
  Bottom 0.4: v156.62,70.88 v148.5,79
N$59  (via drill 0.35)
  Top 0.4: v180.75,75.88 177.62,79 149.88,79 148,80.88 148,81.75 IC1.10 | v187.62,69 191.75,64.88 GPIO2.36
  Bottom 0.4: v187.62,69 v180.75,75.88
N$60  (via drill 0.35)
  Top 0.4: v184.25,81.75 149.25,81.75 IC1.9
  Bottom 0.4: v184.25,81.75 195.62,70.38 195.62,68.62 GPIO2.37
N$167
  Top 0.4: LED1.C 169.12,75 166.62,75 R1.2
(copper drawn outside any net)
  shapes: Top area x4

### Text on the board
Top: 1 | GPIO0 | steper7 | Miguel Angel Díaz Rivera 201511693 | + | steper6 | steper4 | steper2 | GPIO1 | 1 | steper5 | steper3 | steper1 | UNIANDES - ROBOCOL - TRACCIÓN | 1